# EAGLE schematic smpsu (EAGLE 6.4)
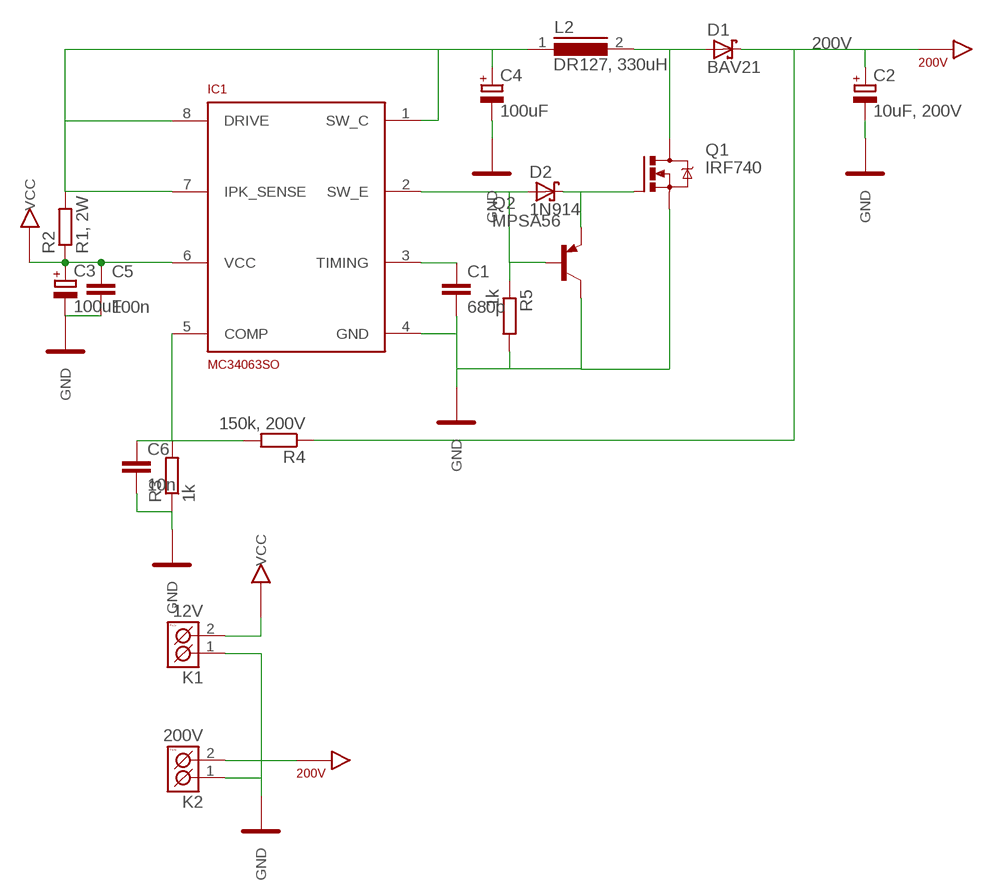
[diagram p0: schematic, sheet 1]

## Parts
C1  680p  C-EUC0805  [C0805]
C2  10uF, 200V  CPOL-EUE3.5-10  [E3,5-10]
C3  100uF  CPOL-EUD  [PANASONIC_D]
C4  100uF  CPOL-EUD  [PANASONIC_D]
C5  100n  C-EUC0805  [C0805]
C6  10n  C-EUC0805  [C0805]
D1  BAV21  SCHOTTKY-DIODEDO35-7  [DO35-7]
D2  1N914  SCHOTTKY-DIODEDO35-7  [DO35-7]
IC1  MC34063SO  [SOP08]
K1  12V  ARK500/2  [ARK500/2]
K2  200V  ARK500/2  [ARK500/2]
L2  DR127, 330uH  DR127  [DR127]
Q1  IRF740  [TO220BV]
Q2  MPSA56  [TO92-CBE]
R2  R1, 2W  R-EU_V234/12  [V234/12]
R3  1k  R-EU_R0805  [R0805]
R4  150k, 200V  R-EU_R0805  [R0805]
R5  1k  R-EU_R0805  [R0805]

## Nets
200V: C2.+ D1.C K2.2(K2) R4.1
GND: C1.2 C2.- C3.- C4.- C5.2 C6.2 IC1.4(GND) K1.1(K1) K2.1(K1) Q1.S Q2.C R3.1 R5.2
N$2: C4.+ IC1.1(SW_C) IC1.7(IPK_SENSE) IC1.8(DRIVE) L2.1 R2.2
N$3: D2.C Q1.G Q2.E
N$4: C6.1 IC1.5(COMP) R3.2 R4.2
N$5: C1.1 IC1.3(TIMING)
N$8: D1.A L2.2 Q1.D
N$10: D2.A IC1.2(SW_E) Q2.B R5.1
VCC: C3.+ C5.1 IC1.6(VCC) K1.2(K2) R2.1

## Library data of the parts
C1 = resistor:C-EU: CAPACITOR, European symbol
C2-C4 = resistor:CPOL-EU: POLARIZED CAPACITOR, European symbol
C5 C6 = rcl:C-EU: CAPACITOR, European symbol
D1 D2 = diode:SCHOTTKY-DIODE: Schottky Diode
IC1 = #Krakonos:MC34063
K1 K2 = #PaJa_92:ARK500/2
L2 = inductors:DR127: High Power Density, High Efficiency, Shielded Inductors Source: coiltronics_dr_series.pdf
Q1 = transistor-power:IRF740: N-CHANNEL MOS FET
Q2 = transistor-pnp:MPSA56*: PNP Transistror Source: http://www.fairchildsemi.com/ds/MM/MMBTA56.pdf
R2-R5 = resistor:R-EU_: RESISTOR, European symbol